# EasyEDA schematic M5 Stick LED Chain Module_2020-05-28_18-31-21.json
TITLE: Iott Stick M5 LED Chain Module; REV: 1.0; Date: 2020-03-31; Sheet: 1/1; Drawn By: Hans R. Tanner; Company: IoTT - Internet of Toy Trains
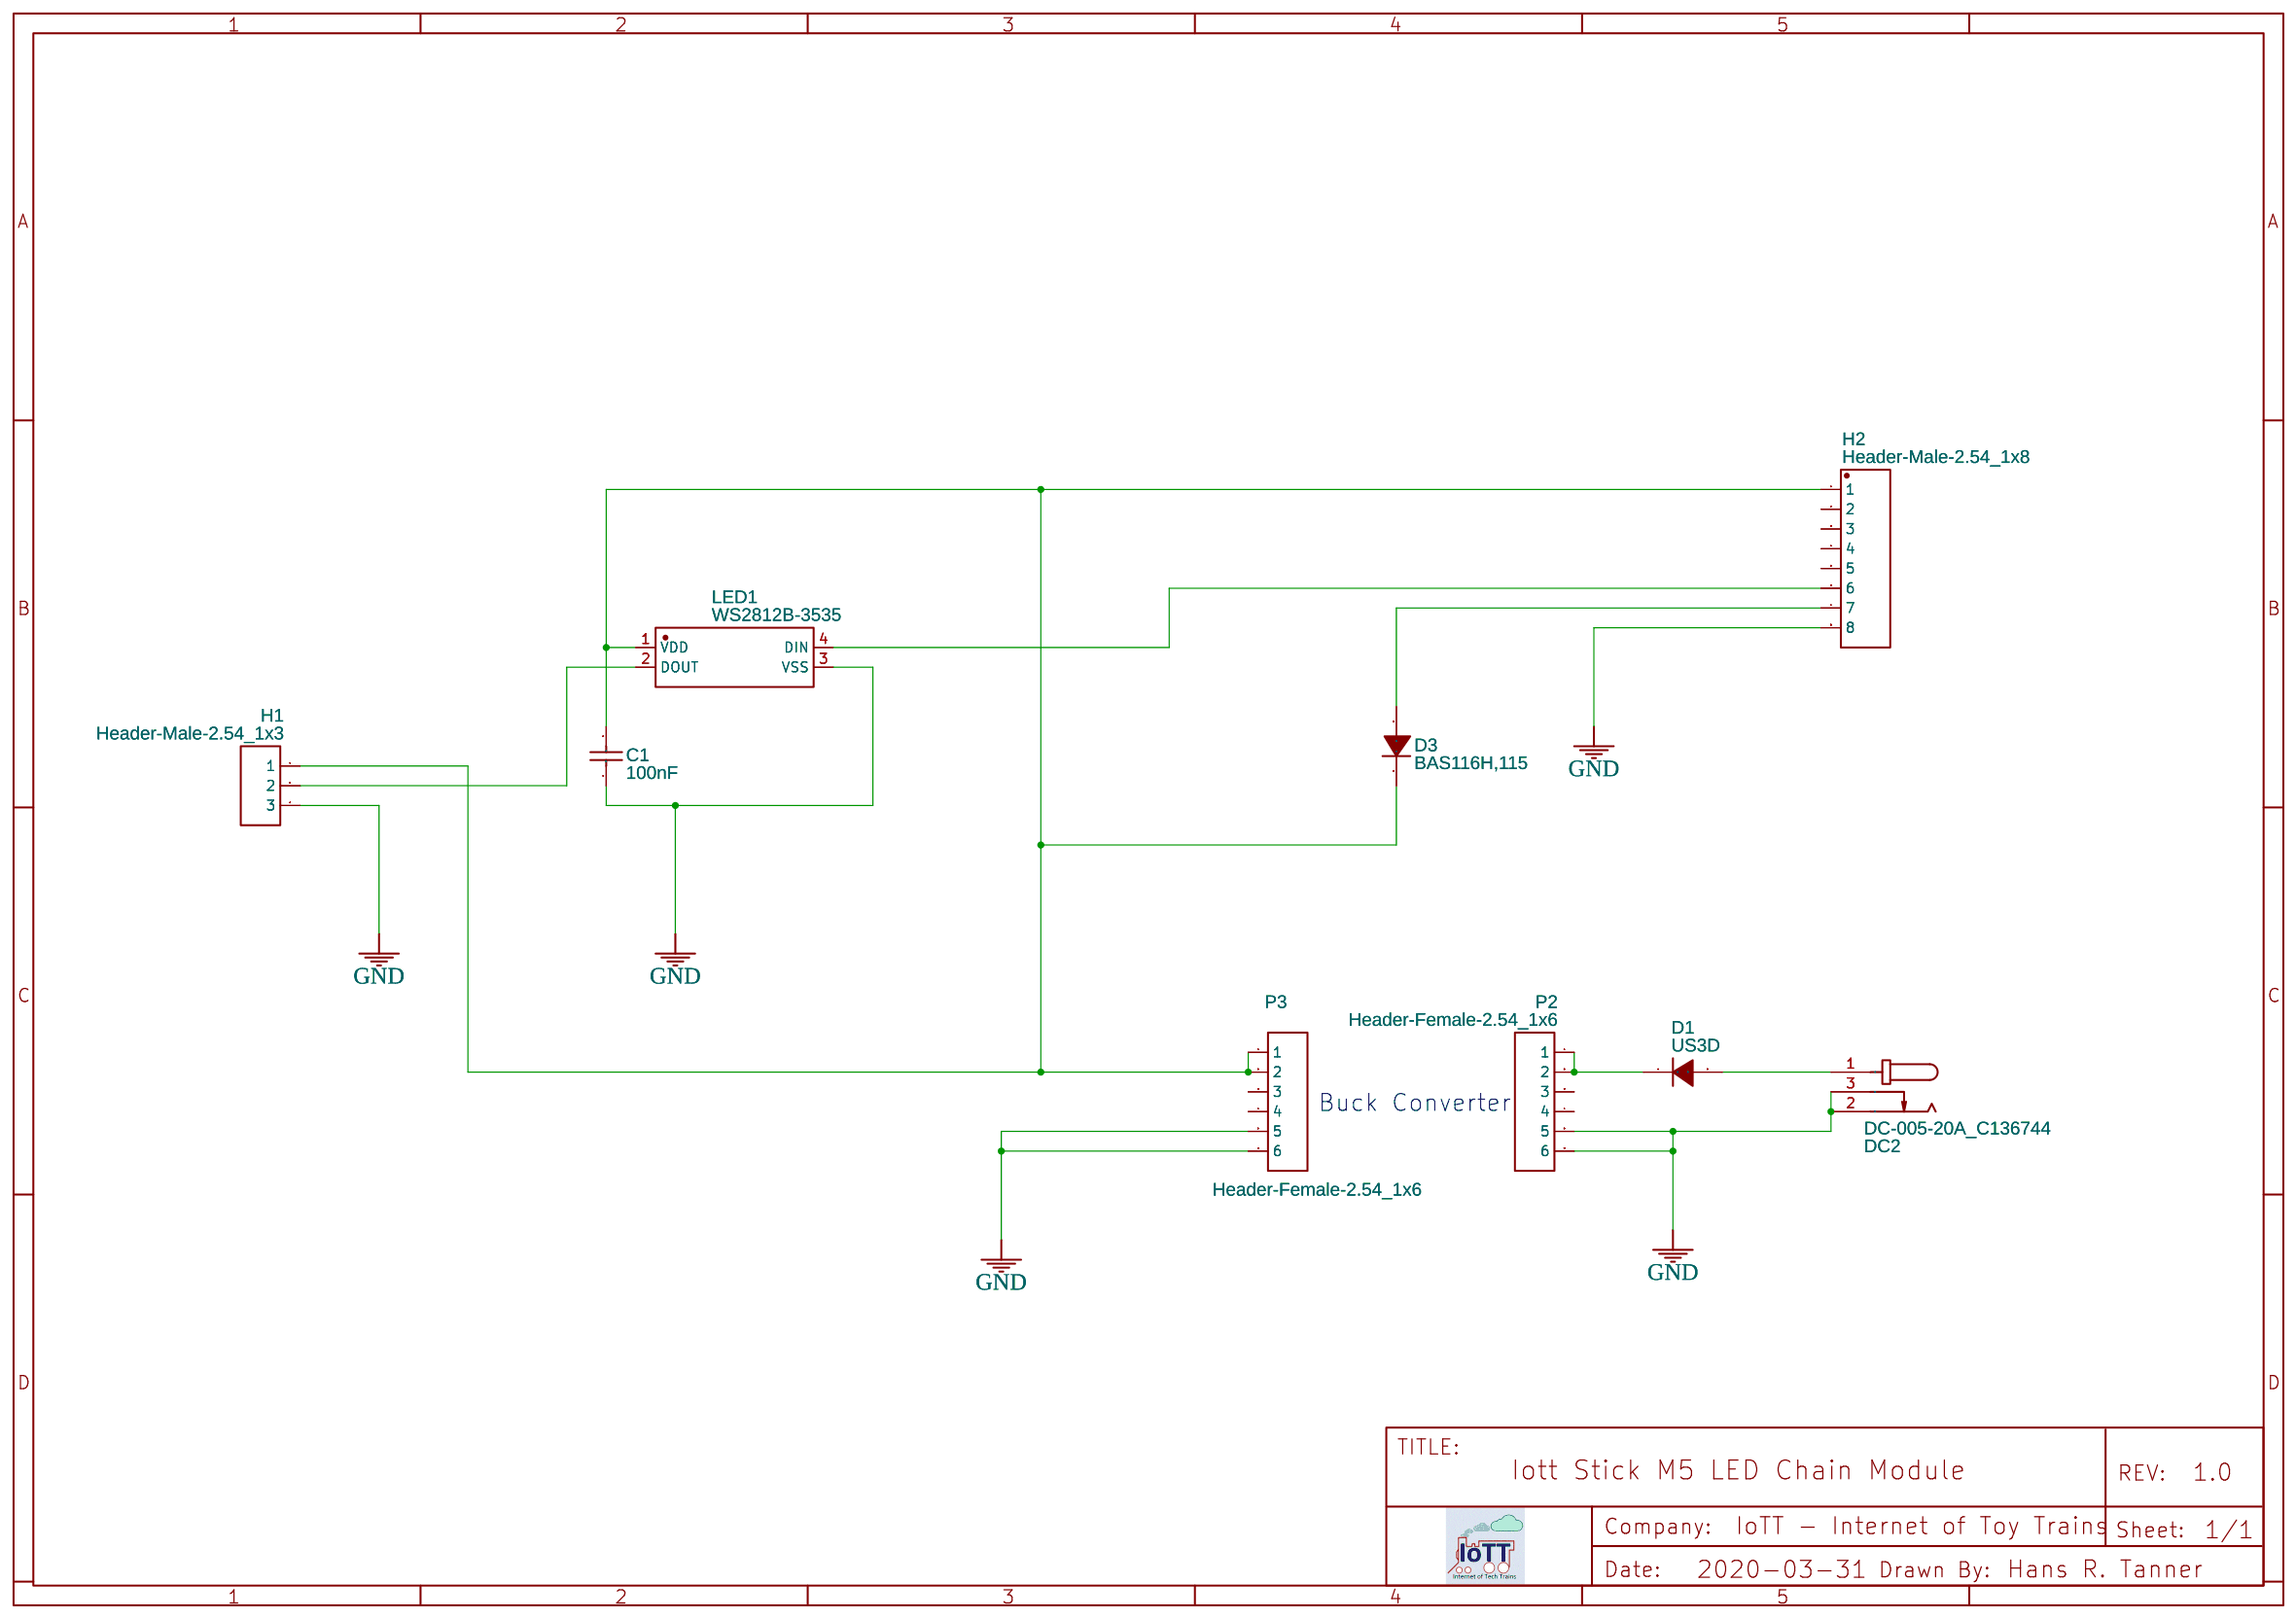
[diagram p0: schematic sheet]

## Parts
C1  100nF  [C0402]
D1  US3D  [SMC_L6.9-W5.9-LS7.9-RD]
D3  BAS116H,115  [SOD-123F_L2.8-W1.8-LS3.7-RD]
DC2  DC-005-20A_C136744  [DC-IN-TH_DC-005-20A]
H1  Header-Male-2.54_1x3  [HDR-TH_3P-P2.54-V]
H2  Header-Male-2.54_1x8  [210S-1X8P]
LED1  WS2812B-3535  [LED-SMD_4P-L3.5-W3.5-TL_WS2812B]
P2  Header-Female-2.54_1x6  [HDR-6X1/2.54]
P3  Header-Female-2.54_1x6  [HDR-6X1/2.54]

## Library data of the parts
C1 = CL05B104KO5NNNC: Supplier: LCSC; Manufacturer: SAMSUNG; LCSC Assembly: Yes; Supplier Part: C1525; SMT Type: Basic
D1 = US3D: Supplier: LCSC; Manufacturer: MDD; Supplier Part: C64964; LCSC Assembly: Yes; SMT Type: Extend
D3 = BAS116H,115: Supplier: LCSC; Manufacturer: Nexperia; Contributor: LCSC; Supplier Part: C74210; LCSC Assembly: Yes; SMT Type: Extend
DC2 = DC-005-20A_C136744: Supplier: LCSC; Manufacturer: HRO; Manufacturer Part: DC-005-20A; Contributor: LCSC; Supplier Part: C136744
H1 = Header-Male-2.54_1x3: Supplier: LCSC; Manufacturer: BOOMELE; Manufacturer Part: Header2.54mm 1*3P; image: //image.lceda.cn/szlcsc/C49257.jpg; Supplier Part: C49257
H2 = Header-Male-2.54_1x8: Supplier: LCSC; Manufacturer: Ckmtw; Manufacturer Part: 210S-1*8P L=11.6MMGold-plated black; Contributor: LCSC; Supplier Part: C124381
LED1 = WS2812B-3535: Supplier: LCSC; Manufacturer: Worldsemi; Contributor: LCSC; Supplier Part: C114583; LCSC Assembly: Yes; SMT Type: Extend
P2 P3 = Header-Female-2.54_1x6: Supplier: LCSC; Manufacturer: BOOMELE; Manufacturer Part: Female header 1*6p; Supplier Part: C40877

## Nets
GND: C1.1 DC2.2 DC2.3 H1.3 H2.8 LED1.3(VSS) P2.5 P2.6 P3.5 P3.6
Net-(C1-2): C1.2 D3.1(K) H1.1 H2.1 LED1.1(VDD) P3.1 P3.2
Net-(D1-1): D1.1 P2.1 P2.2
Net-(D1-2): D1.2 DC2.1
Net-(D3-2): D3.2(A) H2.7
Net-(H1-2): H1.2 LED1.2(DOUT)
Net-(H2-6): H2.6 LED1.4(DIN)

Not connected (* = marked no-connect by the designer): H2 2 3 4 5; P2 3 4; P3 3 4

## Notes on the sheet
- Buck Converter
